# Altium schematic sheet 11-MT7688AN RF Front End.SchDoc
size A3
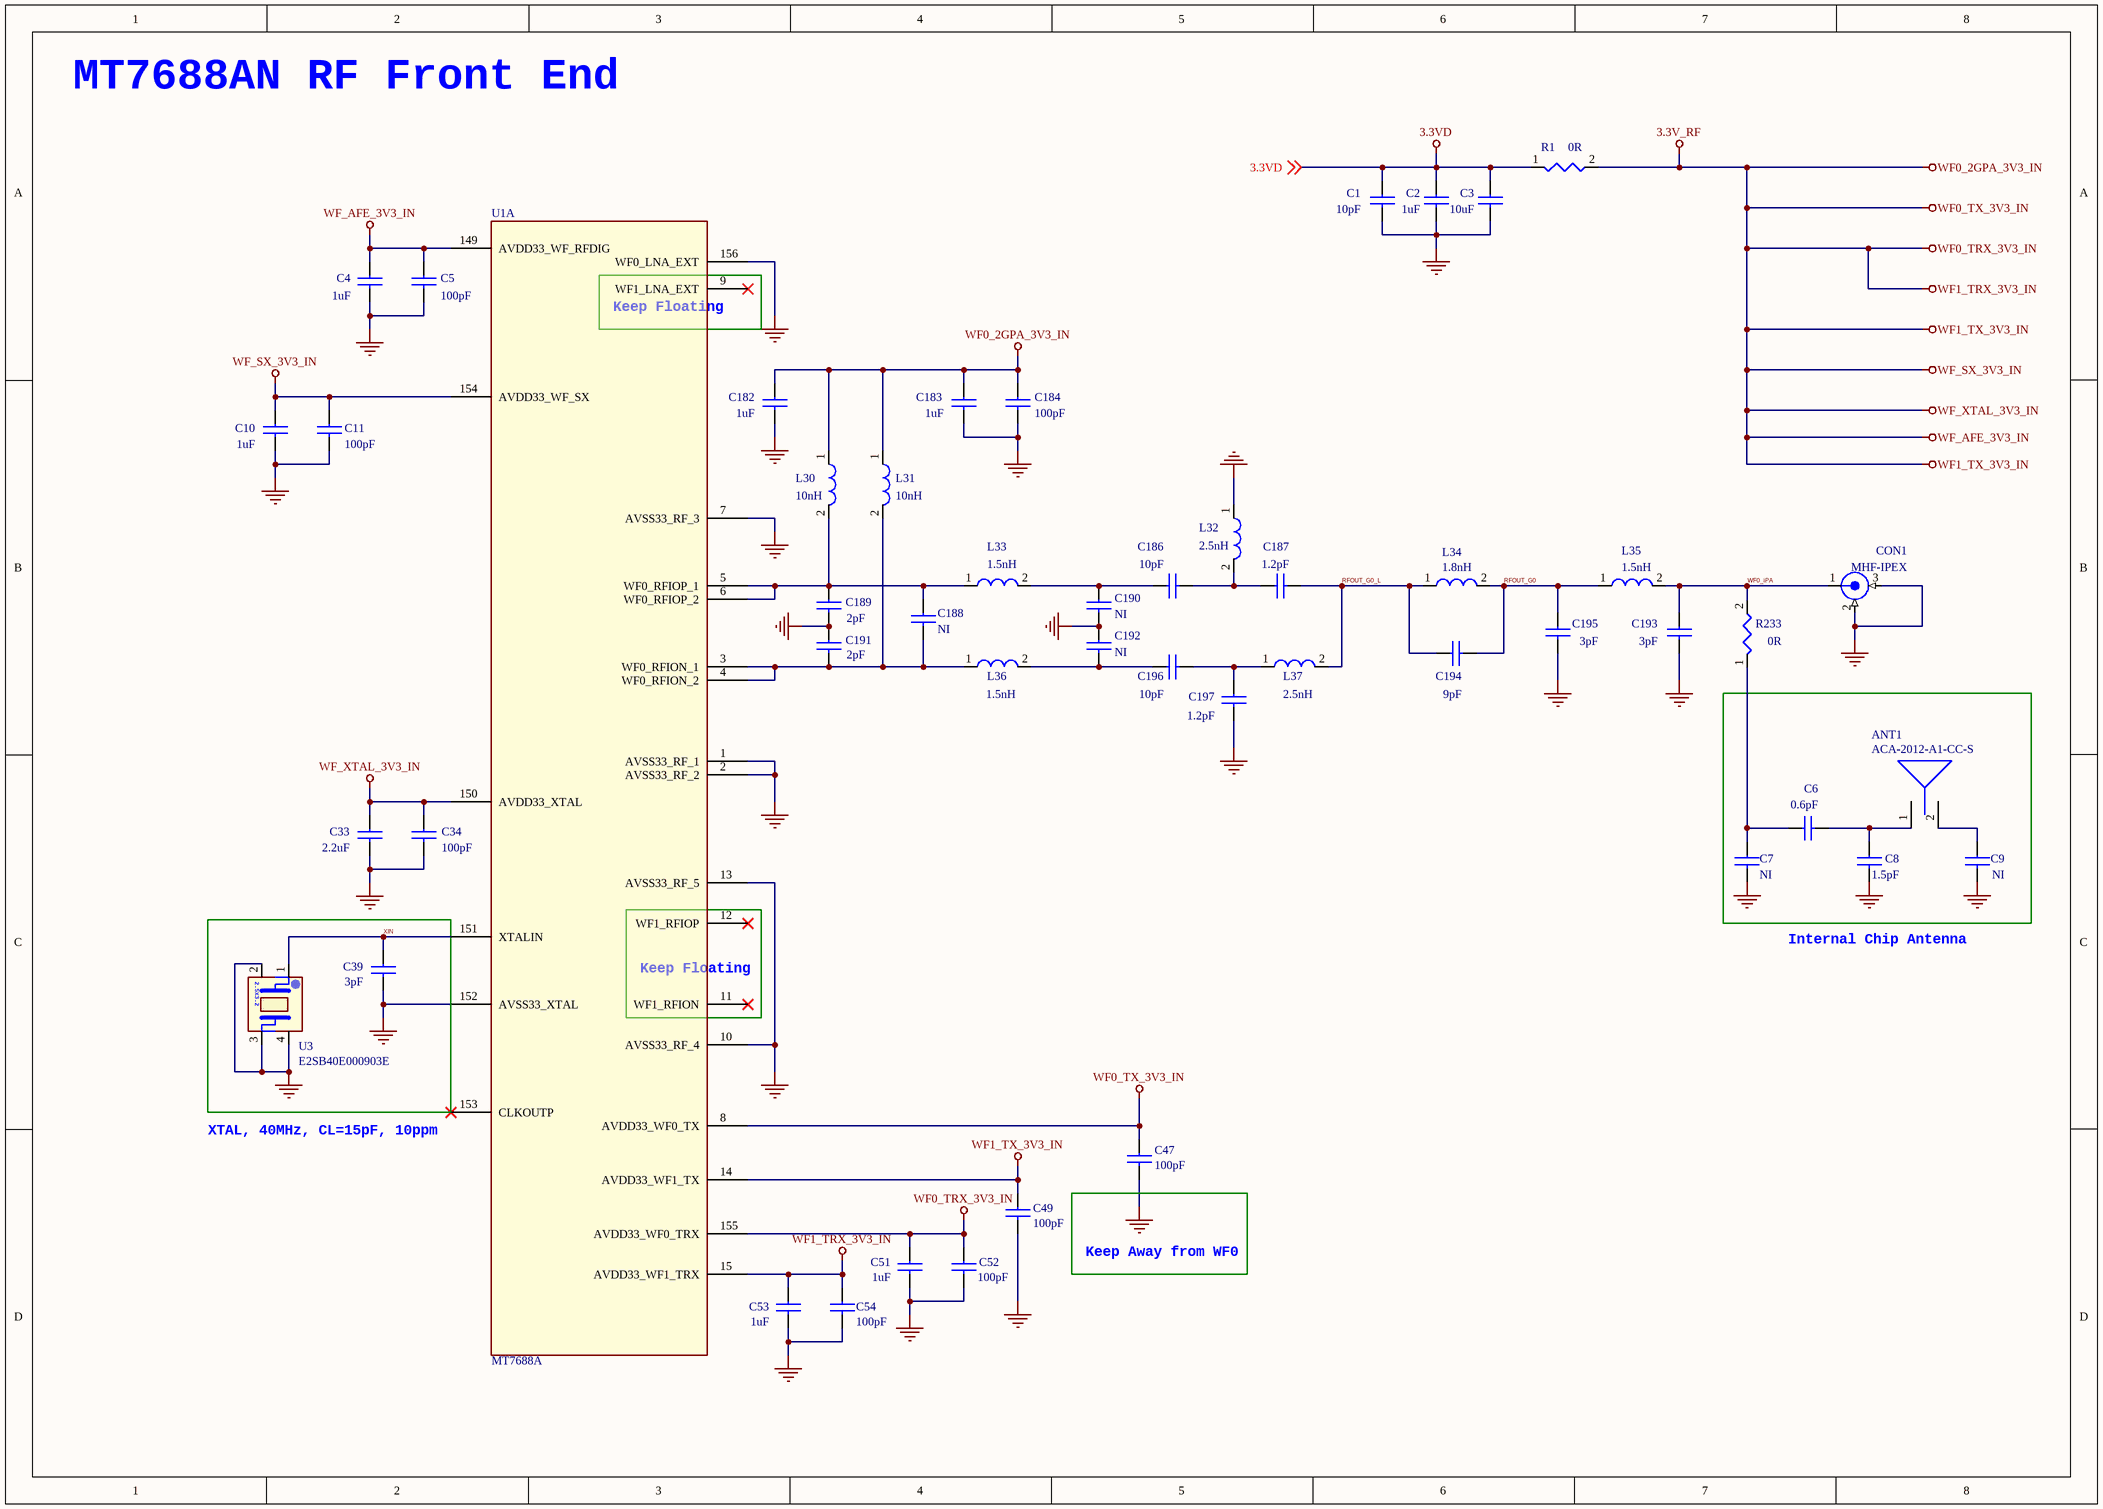
[diagram p0: 11-MT7688AN RF Front End.SchDoc]

## Parts
ANT1  ACA-2012-A1-CC-S  [ACA-2012A]
C1  10pF  [RLC 0201 M35]
C2  1uF  [RLC 0201 M35]
C3  10uF  [RLC 0402 M35]
C4  1uF  [RLC 0201 M35]
C5  100pF  [RLC 0201 M35]
C6  0.6pF  [RLC 0201 M35]
C7  NI  [RLC 0201 M35]
C8  1.5pF  [RLC 0201 M35]
C9  NI  [RLC 0402 M35]
C10  1uF  [RLC 0201 M35]
C11  100pF  [RLC 0201 M35]
C33  2.2uF  [RLC 0402 M35]
C34  100pF  [RLC 0201 M35]
C39  3pF  [RLC 0201 M35]
C47  100pF  [RLC 0201 M35]
C49  100pF  [RLC 0201 M35]
C51  1uF  [RLC 0201 M35]
C52  100pF  [RLC 0201 M35]
C53  1uF  [RLC 0201 M35]
C54  100pF  [RLC 0201 M35]
C182  1uF  [RLC 0201 M35]
C183  1uF  [RLC 0201 M35]
C184  100pF  [RLC 0201 M35]
C186  10pF  [RLC 0201 M35]
C187  1.2pF  [RLC 0201 M35]
C188  NI  [RLC 0201 M35]
C189  2pF  [RLC 0201 M35]
C190  NI  [RLC 0201 M35]
C191  2pF  [RLC 0201 M35]
C192  NI  [RLC 0201 M35]
C193  3pF  [RLC 0201 M35]
C194  9pF  [RLC 0201 M35]
C195  3pF  [RLC 0201 M35]
C196  10pF  [RLC 0201 M35]
C197  1.2pF  [RLC 0201 M35]
CON1  MHF-IPEX  [I-PEX SOCKET]
L30  10nH  [RLC 0201 M35]
L31  10nH  [RLC 0201 M35]
L32  2.5nH  [RLC 0201 M35]
L33  1.5nH  [RLC 0201 M35]
L34  1.8nH  [RLC 0201 M35]
L35  1.5nH  [RLC 0201 M35]
L36  1.5nH  [RLC 0201 M35]
L37  2.5nH  [RLC 0201 M35]
R1  0R  [RLC 0402 M35]
R233  0R  [RLC 0201 M35]
U1  MT7688A  [MT7628AN$2F$DRQFN156$2F$SMD$2F$P0.5$2F$12X12]  (part A of 6)
U3  E2SB40E000903E  [XTAL 2520 M50]

## Nets
3.3V_RF: C4.1 C5.1 C10.1 C11.1 C33.1 C34.1 C47.1 C49.1 C51.1 C52.1 C53.1 C54.1 C182.1 C183.1 C184.1 L30.1 L31.1 R1.2 U1.8(AVDD33_WF0_TX) U1.14(AVDD33_WF1_TX) U1.15(AVDD33_WF1_TRX) U1.149(AVDD33_WF_RFDIG) U1.150(AVDD33_XTAL) U1.154(AVDD33_WF_SX) U1.155(AVDD33_WF0_TRX)  [also labelled WF0_2GPA_3V3_IN, WF0_TRX_3V3_IN, WF0_TX_3V3_IN, WF1_TRX_3V3_IN, WF1_TX_3V3_IN, WF_AFE_3V3_IN, WF_SX_3V3_IN, WF_XTAL_3V3_IN]
3.3VD: C1.1 C2.1 C3.1 R1.1 ; off-sheet 3.3VD
GND: C1.2 C2.2 C3.2 C4.2 C5.2 C7.2 C8.2 C9.2 C10.2 C11.2 C33.2 C34.2 C39.2 C47.2 C49.2 C51.2 C52.2 C53.2 C54.2 C182.2 C183.2 C184.2 C189.2 C190.2 C191.1 C192.1 C193.2 C195.2 C197.2 CON1.2 CON1.3(GNDA) L32.1 U1.1(AVSS33_RF_1) U1.2(AVSS33_RF_2) U1.7(AVSS33_RF_3) U1.10(AVSS33_RF_4) U1.13(AVSS33_RF_5) U1.152(AVSS33_XTAL) U1.156(WF0_LNA_EXT) U3.2(NC) U3.3(X2) U3.4(NC)
RFOUT_G0: C194.2 C195.1 L34.2 L35.1
RFOUT_G0_L: C187.2 C194.1 L34.1 L37.2
WF0_iPA: C193.1 CON1.1 L35.2 R233.2
XIN: C39.1 U1.151(XTALIN) U3.1(X1)
NetANT1_1: ANT1.1(IN) C6.2 C8.1
NetANT1_2: ANT1.2(OUT) C9.1
NetC6_1: C6.1 C7.1 R233.1
NetC186_1: C186.1 C190.1 L33.2
NetC186_2: C186.2 C187.1 L32.2
NetC188_1: C188.1 C189.1 L30.2 L33.1 U1.5(WF0_RFIOP_1) U1.6(WF0_RFIOP_2)
NetC188_2: C188.2 C191.2 L31.2 L36.1 U1.3(WF0_RFION_1) U1.4(WF0_RFION_2)
NetC192_2: C192.2 C196.1 L36.2
NetC196_2: C196.2 C197.1 L37.1

Not connected (* = marked no-connect by the designer): U1 9(WF1_LNA_EXT)* 11(WF1_RFION)* 12(WF1_RFIOP)* 153(CLKOUTP)*

## Notes on the sheet
- MT7688AN RF Front End
- (near U1) Keep Floating
- Internal Chip Antenna
- XTAL, 40MHz, CL=15pF, 10ppm
- Keep Away from WF0
- (in symbol XTAL_3.2x2.5) 2.5x3.2

## Library data of the parts
ANT1 = Antenna_2012
C1-C11 C33 C34 C39 C47 C49 C51-C54 C182-C184 C186-C197 = CAP NP
CON1 = SMA/UFLR
L30-L32 L34 L37 = L/0402
L33 L35 L36 = L/0402: LQP03TN1N5B02D
R1 R233 = RES/0402_3
U1 = MT7620N-n_26
U3 = XTAL_3.2x2.5: XTAL, 40MHz, CL=15pF, 10ppm, -30~+85C